# EAGLE design attiny (EAGLE 6.5.0)
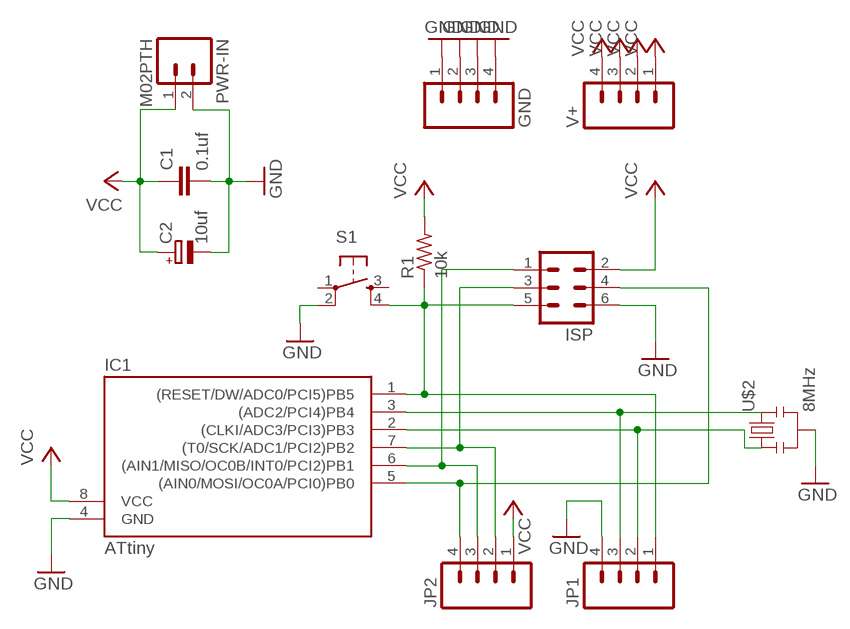
[diagram p0: schematic, sheet 1]

## Parts
C1  0.1uf  C-EU025-025X050  [C025-025X050]
C2  10uf  CPOL-EUE2-4  [E2-4]
GND  M04PTH  [1X04]
IC1  ATtiny  ATTINY13-20P  [DIL08]
ISP  MA03-2  [MA03-2]
JP1  M04PTH  [1X04]
JP2  M04PTH  [1X04]
PWR-IN  M02PTH  [1X02]
R1  10k  R-US_0204/7  [0204/7]
S1  TAC_SWITCHPTH  [TACTILE-PTH]
U$2  8MHz  RESONATORPTH  [RESONATOR-PTH]
V+  M04PTH  [1X04]

## Nets
GND: C1.2 C2.- GND.1 GND.2 GND.3 GND.4 IC1.4(GND) ISP.6 JP1.4 PWR-IN.2 S1.2 U$2.2
N$2: IC1.2((CLKI/ADC3/PCI3)PB3) JP1.2 U$2.1
N$4: IC1.1((RESET/DW/ADC0/PCI5)PB5) ISP.5 JP1.1 R1.1 S1.4
N$5: IC1.7((T0/SCK/ADC1/PCI2)PB2) ISP.3 JP2.2
N$6: IC1.6((AIN1/MISO/OC0B/INT0/PCI2)PB1) ISP.1 JP2.3
N$8: IC1.3((ADC2/PCI4)PB4) JP1.3 U$2.3
N$10: IC1.5((AIN0/MOSI/OC0A/PCI0)PB0) ISP.4 JP2.4
VCC: C1.1 C2.+ IC1.8(VCC) ISP.2 JP2.1 PWR-IN.1 R1.2 V+.1 V+.2 V+.3 V+.4
Unconnected: S1.1 S1.3

## Library data of the parts
C1 = rcl:C-EU: CAPACITOR, European symbol
C2 = rcl:CPOL-EU: POLARIZED CAPACITOR, European symbol
GND JP1 JP2 V+ = SparkFun:M04: Header 4 Standard 4-pin 0.1" header. Use with straight break away headers (SKU : PRT-00116), right angle break away headers (PRT-00553), swiss pins (PRT-00743), machine pins (PRT-00117), and female headers (PRT-00115). Molex polarized connector foot print use with SKU : PRT-08231 with associated crimp pins and housings.
IC1 = avr:ATTINY13: MICROCONTROLLER 1 Kbytes FLASH 64 bytes EEPROM 64 bytes RAM 4-channel 10 bit ADC
ISP = attiny_v2:MA03-2: PIN HEADER
PWR-IN = SparkFun-Connectors:M02: Standard 2-pin 0.1" header. Use with - straight break away headers ( PRT-00116) - right angle break away headers (PRT-00553) - swiss pins (PRT-00743) - machine pins (PRT-00117) - female headers (PRT-00115) Molex polarized connector foot print use with: PRT-08233 with associated crimp pins and housings. 2.54_SCREWTERM for use with PRT-10571. 3.5mm Screw Terminal footprints for PRT-08084 5mm Screw Terminal footprints for use with PRT-08433
R1 = resistor:R-US_: RESISTOR, American symbol
S1 = SparkFun:TAC_SWITCH: Momentary Switch Button commonly used for reset or general input. Spark Fun Electronics SKU : COM-00097
U$2 = SparkFun:RESONATOR: Resonator Small SMD resonator. This is the itty bitty 10/20MHz resonators with built in caps. CSTCE10M0G55 and CSTCE20M0V53. Footprint has been reviewed closely but hasn't been tested yet.

## Board
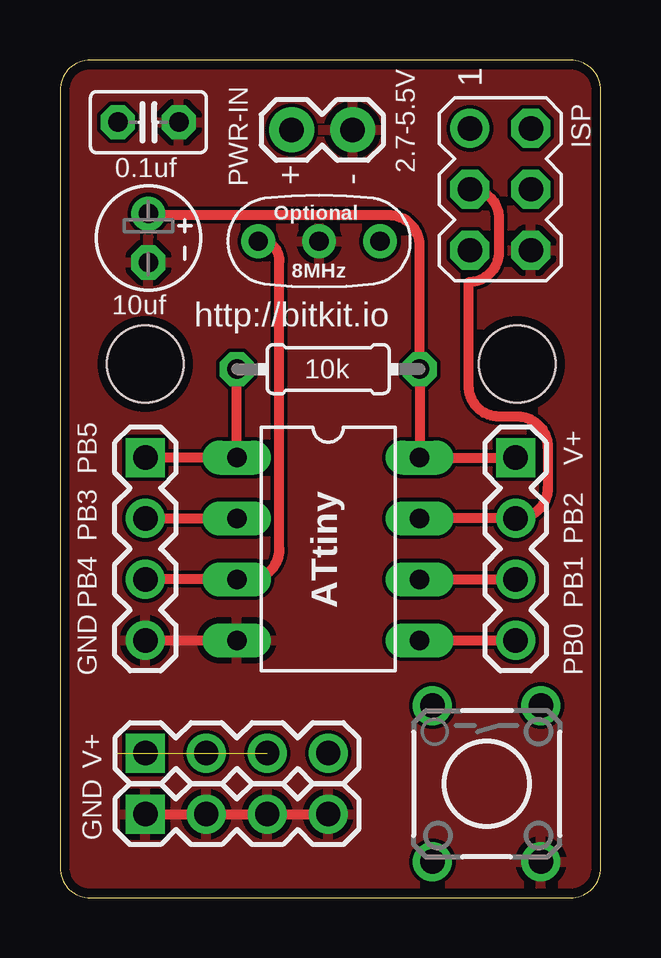
[diagram p1: board, top side]
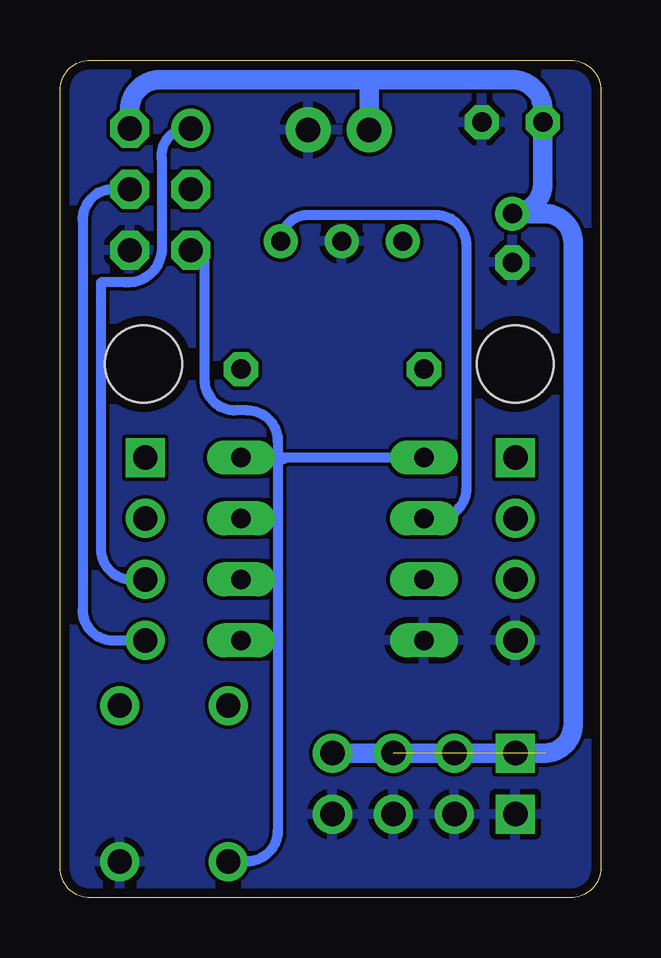
[diagram p2: board, bottom side, seen from below]

Size 22.53 x 34.91 mm. Coordinates in mm from the lower left corner, seen from the top.
Outline: 1.27,34.91 arc90 0,33.65 0,1.27 arc90 1.27,0 21.26,0 arc90 22.53,1.27 22.53,33.65 arc90 21.26,34.91 1.27,34.91
Copper layers (1*16): Top 0.0356mm / dielectric 1.5011mm / Bottom 0.0356mm
Design rules "ATtiny *": minimum track width 0.4mm, minimum drill 13mil, track to track 6mil, track to pad 6mil, pad to pad 6mil, via to via 6mil, smd to smd 6mil, copper to edge 15mil, drill to drill 6mil, minimum pad ring 12mil, minimum via ring 7mil, stop-mask expansion 3mil, vias tented up to drill 0mil, thermal gap 10mil
Holes 3.2 mm at 3.56,22.25 19.05,22.25

### Footprints (pad centres in the part's own frame; a part is rotated, then mirrored left to right if it is on the bottom)
C025-025X050 = drill 0.813 octagon: 1 -1.27,0; 2 1.27,0
E2-4 = drill 0.813 pad 1.27: + -1.016,0 | drill 0.813 pad 1.27 octagon: - 1.016,0
1X04 = drill 1.016 square: 1 0,0 | drill 1.016: 2 2.54,0; 3 5.08,0; 4 7.62,0
DIL08 = drill 0.813 long: 1 -3.81,-3.81; 2 -1.27,-3.81; 3 1.27,-3.81; 4 3.81,-3.81; 5 3.81,3.81; 6 1.27,3.81; 7 -1.27,3.81; 8 -3.81,3.81
MA03-2 = drill 1.016: 1 -2.54,-1.27 | drill 1.016 octagon: 2 -2.54,1.27; 3 0,-1.27; 4 0,1.27; 5 2.54,-1.27; 6 2.54,1.27
1X02 = drill 1.016 pad 1.88: 1 0,0; 2 2.54,0
0204/7 = drill 0.813 octagon: 1 -3.81,0; 2 3.81,0
TACTILE-PTH = drill 1.016: 1 -3.251,2.261; 2 3.251,2.261; 3 -3.251,-2.261; 4 3.251,-2.261
RESONATOR-PTH = drill 0.8: 1 -2.54,0; 2 0,0; 3 2.54,0

### Placement (x,y rotation side)
C1  3.68,32.32 0 top
C2  3.68,27.5 270 top
GND  3.56,3.49 0 top
IC1  11.18,14.54 270 top
ISP  18.35,29.53 270 top
JP1  3.56,18.35 270 top
JP2  18.98,18.35 270 top
PWR-IN  9.65,32 0 top
R1  11.18,22.03 0 top
S1  17.78,4.76 270 top
U$2  10.79,27.37 180 top
V+  3.56,6.03 0 top

### Tracks (layer width: path | path; a pad name or v marks a point on that pad's centre or on a via)
GND
  Top 0.406: JP1.4 IC1.4 | GND.1 GND.2 GND.3 GND.4
  pour Bottom: 0,34.8 22.35,34.8 22.61,0 0,0
  pour Top: 0,34.8 22.35,35.05 22.35,0 0,0
N$2
  Top 0.406: JP1.2 IC1.2
  Bottom 0.406: IC1.2 6.86,15.81 arc-90 5.59,17.08 5.59,27.18 arc-90 6.86,28.45 12.06,28.45 arc-90 13.34,27.43 U$2.1
N$4
  Top 0.406: JP1.1 IC1.1 R1.1
  Bottom 0.406: IC1.1 13.14,18.35 arc-90 13.21,18.29 arc-90 13.46,18.03 | 13.46,18.03 13.46,2.79 arc90 14.73,1.52 15.51,1.52 arc-90 S1.4 | ISP.5 arc90 16.51,26.42 16.51,21.59 arc-90 15.24,20.32 14.73,20.32 arc90 13.46,19.05 13.46,18.03
N$5
  Top 0.406: IC1.7 JP2.2 19.05,15.81 arc90 20.32,17.08 20.32,18.8 arc90 19.05,20.07 18.29,20.07 arc-90 17.02,21.34 17.02,25.65 arc90 18.29,26.92 18.29,28.32 arc90 ISP.3
N$6
  Top 0.406: IC1.6 JP2.3
  Bottom 0.406: ISP.1 17.27,32.07 arc-90 18.3,30.8 18.3,26.92 arc90 19.81,25.65 20.83,25.65 20.83,14.54 arc-90 19.56,13.27 JP2.3
N$8
  Top 0.406: JP1.3 IC1.3 7.87,13.27 arc90 9.14,14.54 9.14,26.54 arc90 8.26,27.43 U$2.3
N$10
  Top 0.406: IC1.5 JP2.4
  Bottom 0.406: ISP.4 20.32,29.53 arc-90 21.59,28.26 21.59,12 arc-90 20.32,10.73 JP2.4
VCC  (3 unrouted)
  Top 0.406: IC1.8 JP2.1 | 14.48,18.29 14.99,18.29 IC1.8 | 14.99,22.61 R1.2 | R1.2 14.99,27.18 arc90 13.72,28.45 3.62,28.45 arc90 C2.+ | R1.2 IC1.8
  Bottom 0.813: PWR-IN.1 9.65,34.1 | 9.65,34.1 18.35,34.1 arc-90 19.62,32.83 ISP.2 | 9.65,34.1 3.68,34.1 arc90 2.41,32.83 C1.1 2.41,29.78 arc90 C2.+ 2.29,28.51 arc90 1.15,27.24 1.15,7.3 arc90 2.29,6.03 V+.4

### Text on the board
tNames: 2.7-5.5V | + | - | Optional | 8MHz | http://bitkit.io | PB5 | V+ | PB3 | PB2 | PB4 | PB1 | GND | PB0